# EAGLE design schema (EAGLE 9.6.2)
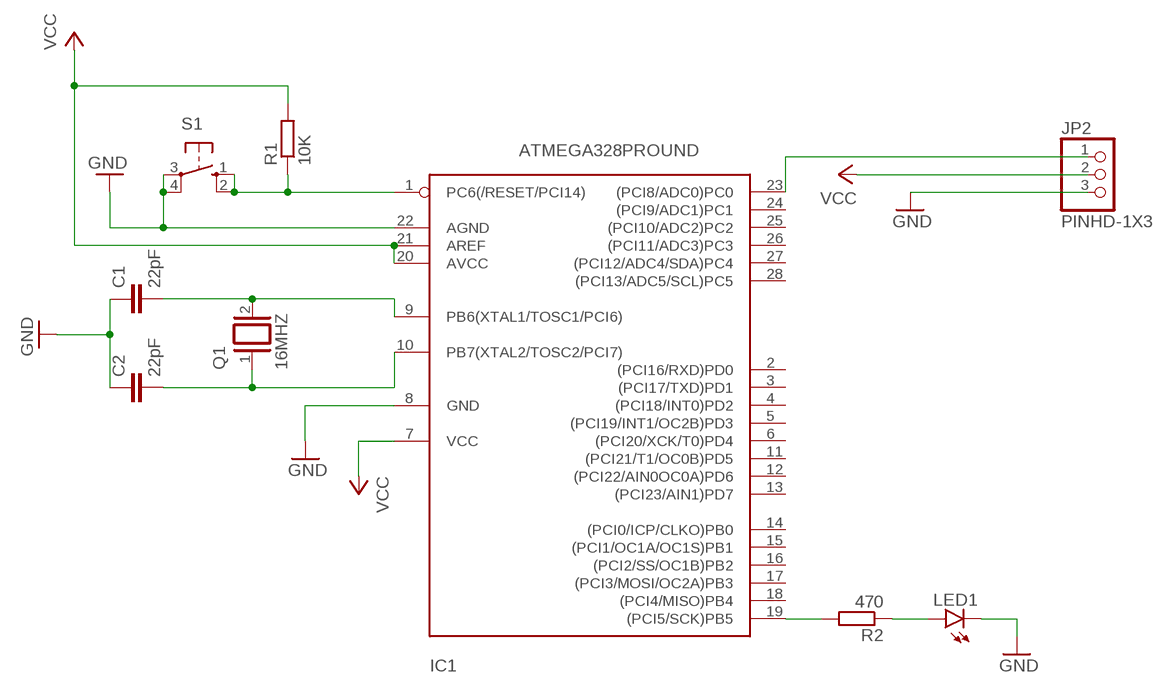
[diagram p0: schematic, sheet 1]

## Parts
C1  22pF  C-EU025-025X050  [C025-025X050]
C2  22pF  C-EU025-025X050  [C025-025X050]
IC1  ATMEGA328PROUND  [DIL28-3-ROUND]
JP2  PINHD-1X3  [1X03]
LED1  LED3MM  [LED3MM]
Q1  16MHZ  XTAL/S  [QS]
R1  10K  R-EU_0204/7  [0204/7]
R2  470  R-EU_0204/7  [0204/7]
S1  10-XX  [B3F-10XX]

## Nets
GND: C1.1 C2.1 IC1.8(GND) IC1.22(AGND) JP2.3 LED1.K(C) S1.3(P) S1.4(P1)
N$1: IC1.19((PCI5/SCK)PB5) R2.2
N$2: IC1.1(PC6(/RESET/PCI14)) R1.1 S1.1(S) S1.2(S1)
N$3: C2.2 IC1.10(PB7(XTAL2/TOSC2/PCI7)) Q1.1
N$5: LED1.A R2.1
N$6: C1.2 IC1.9(PB6(XTAL1/TOSC1/PCI6)) Q1.2
N$7: IC1.23((PCI8/ADC0)PC0) JP2.1
VCC: IC1.7(VCC) IC1.20(AVCC) IC1.21(AREF) JP2.2 R1.2
Unconnected: IC1.2((PCI16/RXD)PD0) IC1.3((PCI17/TXD)PD1) IC1.4((PCI18/INT0)PD2) IC1.5((PCI19/INT1/OC2B)PD3) IC1.6((PCI20/XCK/T0)PD4) IC1.11((PCI21/T1/OC0B)PD5) IC1.12((PCI22/AIN0OC0A)PD6) IC1.13((PCI23/AIN1)PD7) IC1.14((PCI0/ICP/CLKO)PB0) IC1.15((PCI1/OC1A/OC1S)PB1) IC1.16((PCI2/SS/OC1B)PB2) IC1.17((PCI3/MOSI/OC2A)PB3) IC1.18((PCI4/MISO)PB4) IC1.24((PCI9/ADC1)PC1) IC1.25((PCI10/ADC2)PC2) IC1.26((PCI11/ADC3)PC3) IC1.27((PCI12/ADC4/SDA)PC4) IC1.28((PCI13/ADC5/SCL)PC5)

## Library data of the parts
C1 C2 = rcl:C-EU: CAPACITOR, European symbol; SPICEPREFIX: C
IC1 = atmega328:ATMEGA328*P: MICROCONTROLLER 32 kBytes FLASH 2 kBytes SRAM 1 kBytes EEPROM USART 8-channel 10 bit ADC
JP2 = Connector:PINHD-1X3: PIN HEADER; CATEGORY: CONNECTOR; SUB-CATEGORY: PIN-HEADER
LED1 = led:LED: LED OSRAM: - CHIPLED LG R971, LG N971, LY N971, LG Q971, LY Q971, LO R971, LY R971 LH N974, LH R974 LS Q976, LO Q976, LY Q976 LO Q996 - Hyper CHIPLED LW Q18S LB Q993, LB Q99A, LB R99A - SideLED LS A670, LO A670, LY A670, LG A670, LP A670 LB A673, LV A673, LT A673, LW A673 LH A674 LY A675 LS A676, LA A676, LO A676, LY A676, LW A676 LS A679, LY A679, LG A679 - Hyper Micro SIDELED® LS Y876, LA Y876, LO Y876, LY Y876 LT Y87S - SmartLED LW L88C, LW L88S LB L89C, LB L89S, LG L890 LS L89K, LO L89K, LY L89K LS L896, LA L896, LO L896, LY L896 - TOPLED LS T670, LO T670, LY T670, LG T670, LP T670 LSG T670, LSP T670, LSY T670, LOP T670, LYG T670 LG T671, LOG T671, LSG T671 LB T673, LV T673, LT T673, LW T673 LH T674 LS T676, LA T676, LO T676, LY T676, LB T676, LH T676, LSB T676, LW T676 LB T67C, LV T67C, LT T67C, LS T67K, LO T67K, LY T67K, LW E67C LS E67B, LA E67B, LO E67B, LY E67B, LB E67C, LV E67C, LT E67C LW T67C LS T679, LY T679, LG T679 LS T770, LO T770, LY T770, LG T770, LP T770 LB T773, LV T773, LT T773, LW T773 LH T774 LS E675, LA E675, LY E675, LS T675 LS T776, LA T776, LO T776, LY T776, LB T776 LHGB T686 LT T68C, LB T68C - Hyper Mini TOPLED® LB M676 - Mini TOPLED Santana® LG M470 LS M47K, LO M47K, LY M47K Source: http://www.osram.convergy.de LUXEON: - LUMILED® LXK2-PW12-R00, LXK2-PW12-S00, LXK2-PW14-U00, LXK2-PW14-V00 LXK2-PM12-R00, LXK2-PM12-S00, LXK2-PM14-U00 LXK2-PE12-Q00, LXK2-PE12-R00, LXK2-PE12-S00, LXK2-PE14-T00, LXK2-PE14-U00 LXK2-PB12-K00, LXK2-PB12-L00, LXK2-PB12-M00, LXK2-PB14-N00, LXK2-PB14-P00, LXK2-PB14-Q00 LXK2-PR12-L00, LXK2-PR12-M00, LXK2-PR14-Q00, LXK2-PR14-R00 LXK2-PD12-Q00, LXK2-PD12-R00, LXK2-PD12-S00 LXK2-PH12-R00, LXK2-PH12-S00 LXK2-PL12-P00, LXK2-PL12-Q00, LXK2-PL12-R00 Source: www.luxeon.com KINGBRIGHT: KA-3528ASYC Source: www.kingbright.com
Q1 = special:XTAL/S: CRYSTAL
R1 R2 = rcl:R-EU_: RESISTOR, European symbol; SPICEPREFIX: R
S1 = switch-omron:10-XX: OMRON SWITCH; MPN: B3F-1000; OC_FARNELL: 176432; OC_NEWARK: 36M3542

## Board
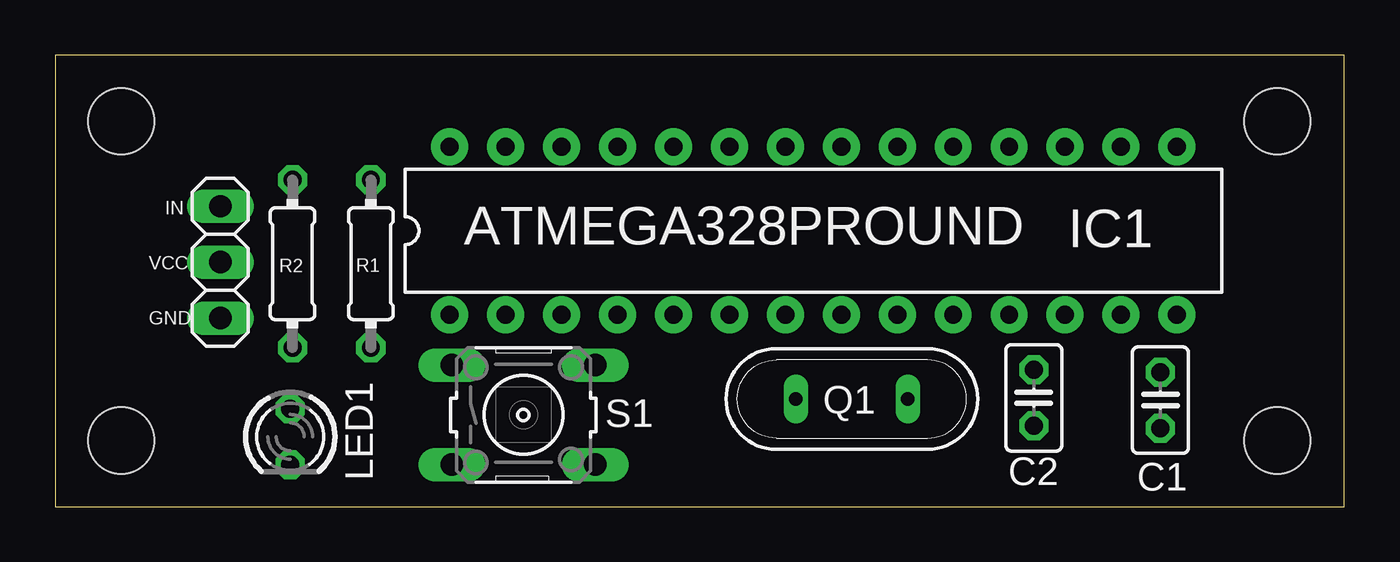
[diagram p1: board, top side]
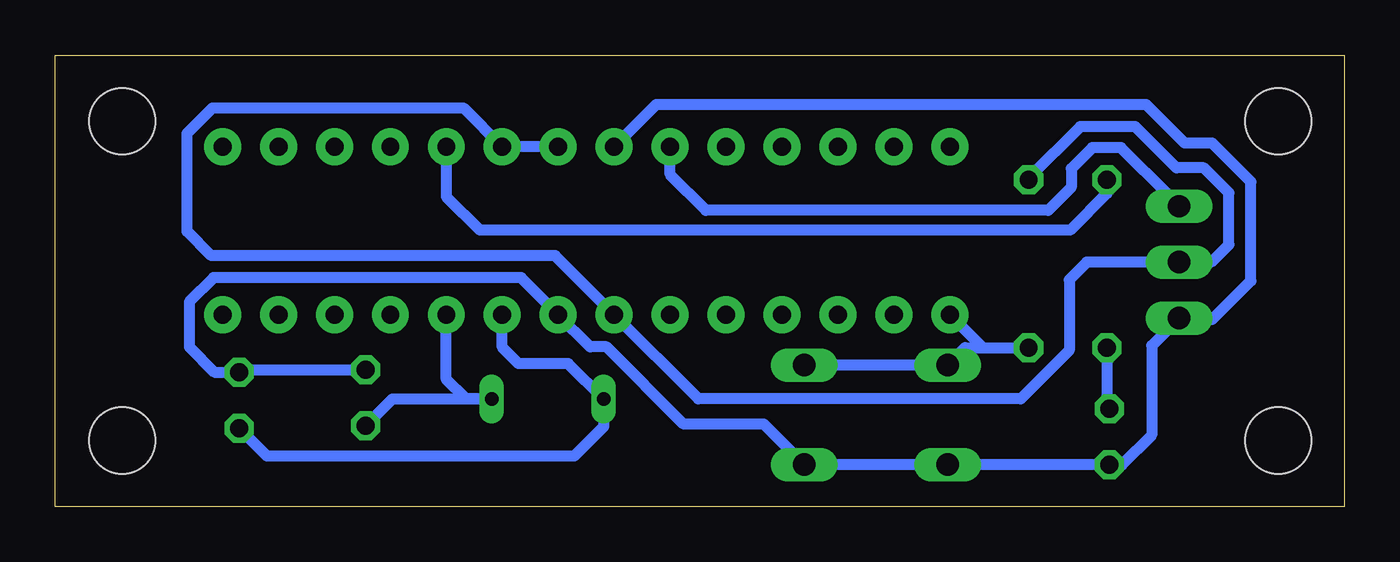
[diagram p2: board, bottom side, seen from below]

Size 58.55 x 20.5 mm. Coordinates in mm from the lower left corner, seen from the top.
Outline: 0,0 58.55,0 58.55,20.5 0,20.5 0,0
Copper layers (1*16): Top 0.035mm / dielectric 1.5mm / Bottom 0.035mm
Design rules "default": minimum track width 6mil, minimum drill 0.35mm, track to track 6mil, track to pad 6mil, pad to pad 6mil, via to via 6mil, smd to smd 6mil, copper to edge 40mil, drill to drill 6mil, minimum pad ring 10mil, minimum via ring 8mil, stop-mask expansion 4mil, vias tented up to drill 0mil, thermal gap 10mil
Holes 3 mm at 3,17.5 3,3 55.5,3 55.5,17.5

### Footprints (pad centres in the part's own frame; a part is rotated, then mirrored left to right if it is on the bottom)
C025-025X050 = drill 0.813 octagon: 1 -1.27,0; 2 1.27,0
DIL28-3-ROUND = drill 0.813 pad 1.676: 1 -16.51,-3.81; 2 -13.97,-3.81; 3 -11.43,-3.81; 4 -8.89,-3.81; 5 -6.35,-3.81; 6 -3.81,-3.81; 7 -1.27,-3.81; 8 1.27,-3.81; 9 3.81,-3.81; 10 6.35,-3.81; 11 8.89,-3.81; 12 11.43,-3.81; 13 13.97,-3.81; 14 16.51,-3.81; 15 16.51,3.81; 16 13.97,3.81; 17 11.43,3.81; 18 8.89,3.81; 19 6.35,3.81; 20 3.81,3.81; 21 1.27,3.81; 22 -1.27,3.81; 23 -3.81,3.81; 24 -6.35,3.81; 25 -8.89,3.81; 26 -11.43,3.81; 27 -13.97,3.81; 28 -16.51,3.81
1X03 = drill 1.016 long: 1 -2.54,0; 2 0,0; 3 2.54,0
LED3MM = drill 0.813 octagon: A -1.27,0; K 1.27,0
QS = drill 0.61 long: 1 -2.54,0; 2 2.54,0
0204/7 = drill 0.813 octagon: 1 -3.81,0; 2 3.81,0
B3F-10XX = drill 1.016 long: 1 -3.251,2.261; 2 3.251,2.261; 3 -3.251,-2.261; 4 3.251,-2.261

### Placement (x,y rotation side)
C1  50.19,4.84 270 top
C2  44.44,4.94 270 top
IC1  34.43,12.53 0 top
JP2  7.5,11.1 270 top
LED1  10.68,3.17 270 top
Q1  36.18,4.89 180 top
R1  14.34,11.03 90 top
R2  10.78,11.03 90 top
S1  21.27,4.17 0 top

### Tracks (layer width: path | path; a pad name or v marks a point on that pad's centre or on a via)
GND
  Bottom 0.508: C2.1 50.09,6.21 C1.1 51.31,6.11 52.45,7.25 52.45,9.3 51.35,10.4 37.38,10.4 IC1.8 35.7,8.7 34.25,7.25 33.5,7.25 30,3.75 26.36,3.75 S1.4 S1.3 LED1.K 10.1,1.9 8.75,3.25 8.75,7.31 JP2.3 7.44,8.5 6,8.5 4.25,10.25 4.25,14.75 6,16.5 7.25,16.5 9,18.25 31.25,18.25 IC1.22
N$1
  Bottom 0.508: 10.95,14.84 R2.2 10.78,14.22 12.45,12.55 39.25,12.55 40.78,14.08 IC1.19
N$2
  Bottom 0.508: S1.2 S1.1 17.23,7.22 16.42,7.22 | 16.42,7.22 R1.1 | IC1.1 16.42,7.22
N$3
  Bottom 0.508: C2.2 43.22,4.89 Q1.1 39.89,4.89 40.78,5.78 IC1.10
N$5
  Bottom 0.508: R2.1 10.78,4.54 LED1.A
N$6
  Bottom 0.508: IC1.9 38.24,7.24 37.5,6.5 35.25,6.5 Q1.2 33.64,3.64 34.98,2.3 48.92,2.3 C1.2
N$7
  Bottom 0.508: JP2.1 8,14.14 8,14.15 10.15,16.3 11.45,16.3 12.4,15.35 12.4,14.5 13.45,13.45 29,13.45 30.62,15.07 IC1.23
VCC
  Bottom 0.508: IC1.21 IC1.20 40,18.1 51.4,18.1 52.55,16.95 52.55,12.5 51.45,11.4 35.84,11.4 IC1.7 29.34,4.9 14.7,4.9 12.5,7.1 12.5,10.3 11.7,11.1 JP2.2 6.05,11.1 5.25,11.9 5.25,14.25 6.38,15.38 7.62,15.38 9.5,17.25 12,17.25 14.34,14.91 R1.2

### Text on the board
tPlace: IN | VCC | GND